# Altium schematic sheet Half-H stage.SchDoc
size A4
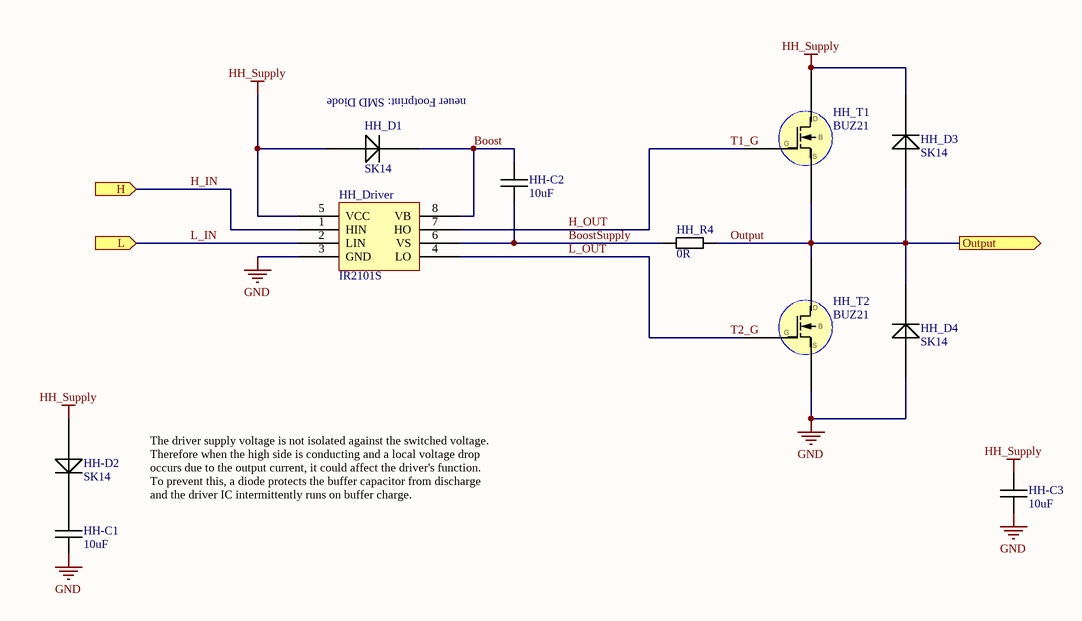
[diagram p0: Half-H stage.SchDoc]

## Parts
HH-C1  10uF  [C 0805 / 2012]
HH-C2  10uF  [C 0805 / 2012]
HH-C3  10uF  [Header 1x2+1 1.0mm]
HH-D2  SK14  [SC-90]
HH_D1  SK14  [SC-90]
HH_D3  SK14  [SC-90]
HH_D4  SK14  [SC-90]
HH_Driver  IR2101S  [SOIC-8]
HH_R4  0R  [R 0805 / 2012 wide]
HH_T1  BUZ21  [TO-220 AB]
HH_T2  BUZ21  [TO-220 AB]

## Ports
H (in), L (in), Output (out)

## Nets
GND: HH-C1.2 HH-C3.2 HH_D4.2 HH_Driver.3(GND) HH_T2.3
HH_Supply: HH-C3.1 HH-D2.2 HH_D1.2 HH_D3.1 HH_Driver.5(VCC) HH_T1.2
Boost: HH-C2.1 HH_D1.1 HH_Driver.8(VB)
BoostSupply: HH-C2.2 HH_Driver.6(VS) HH_R4.1
H_IN: HH_Driver.1(HIN) ; port H
H_OUT: HH_Driver.7(HO) HH_T1.1  [also labelled T1_G]
L_IN: HH_Driver.2(LIN) ; port L
L_OUT: HH_Driver.4(LO) HH_T2.1  [also labelled T2_G]
Output: HH_D3.2 HH_D4.1 HH_R4.2 HH_T1.3 HH_T2.2 ; port Output
NetHH-C1_1: HH-C1.1 HH-D2.1

## Notes on the sheet
- (near HH_D1) neuer Footprint: SMD Diode
- The driver supply voltage is not isolated against the switched voltage.
  Therefore when the high side is conducting and a local voltage drop
  occurs due to the output current, it could affect the driver's function.
  To prevent this, a diode protects the buffer capacitor from discharge
  and the driver IC intermittently runs on buffer charge.

## Library data of the parts
HH-C1-HH-C3 = Capacitor
HH-D2 HH_D1 HH_D3 HH_D4 = Diode
HH_Driver = IR21xx: High and Low Side Driver; Website: http://www.irf.com/part/High-and-Low-Side-Driver-Noninverting-Inputs/_/A~IR2101
HH_R4 = Resistor
HH_T1 HH_T2 = FET N-Channel: Enhancement Type